# Altium schematic sheet RTL8367N.SchDoc
size A4; SheetNumber: 1; SheetTotal: 4
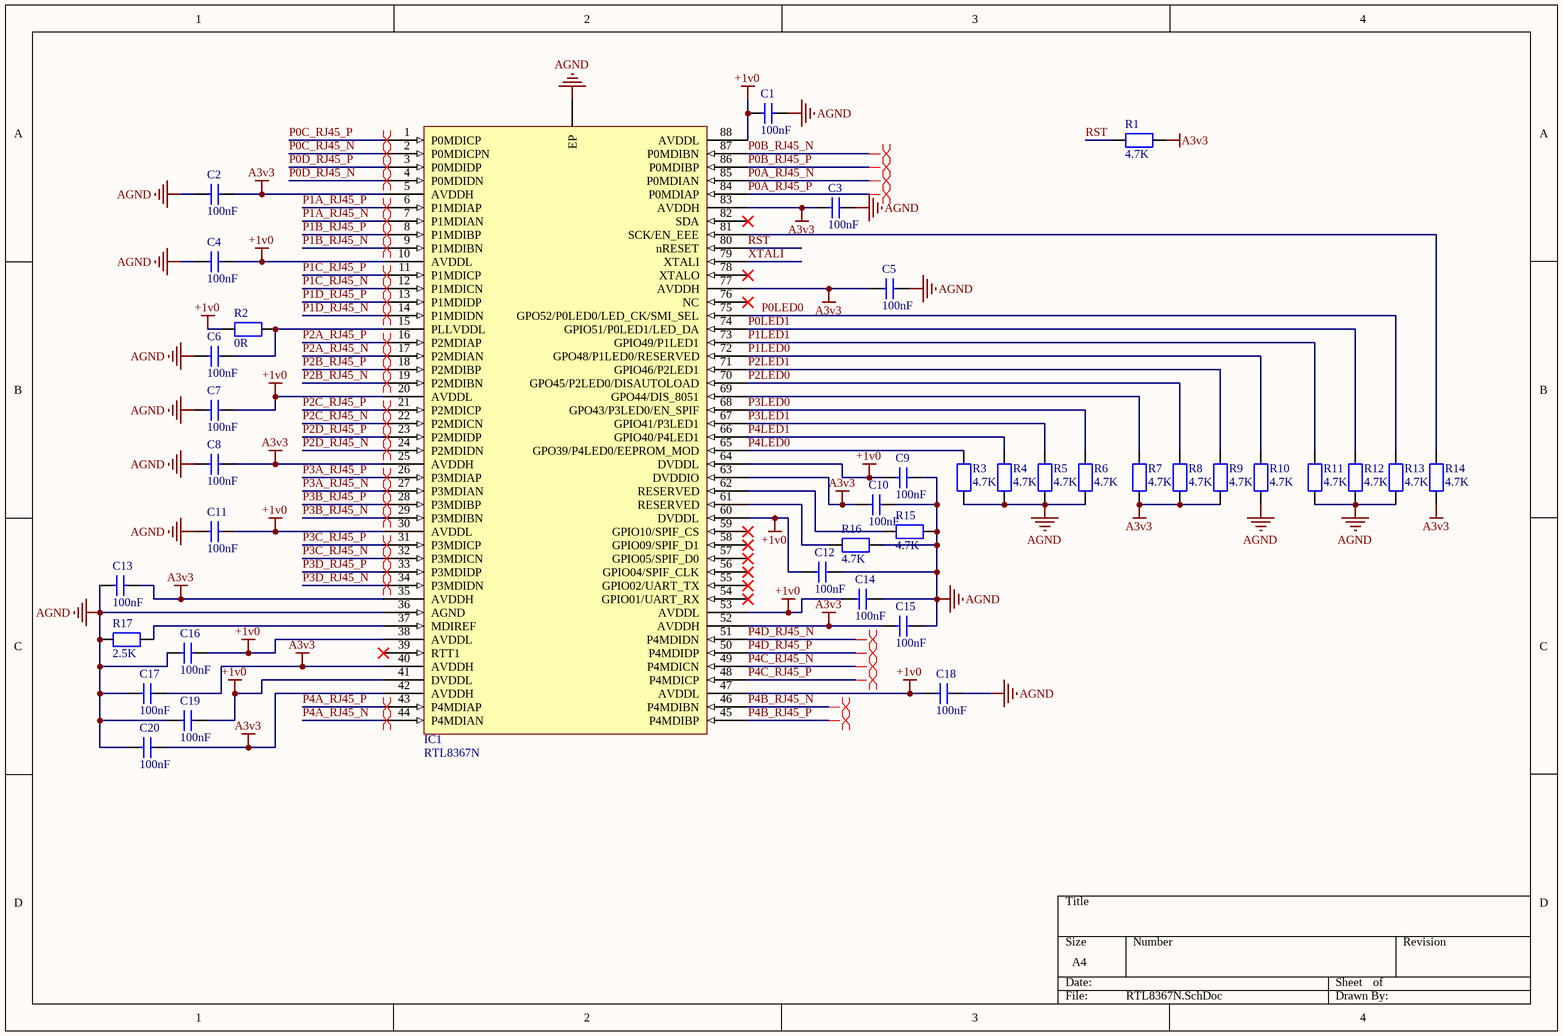
[diagram p0: RTL8367N.SchDoc]

## Parts
C1  100nF  [C-0603]
C2  100nF  [C-0603]
C3  100nF  [C-0603]
C4  100nF  [C-0603]
C5  100nF  [C-0603]
C6  100nF  [C-0603]
C7  100nF  [C-0603]
C8  100nF  [C-0603]
C9  100nF  [C-0603]
C10  100nF  [C-0603]
C11  100nF  [C-0603]
C12  100nF  [C-0603]
C13  100nF  [C-0603]
C14  100nF  [C-0603]
C15  100nF  [C-0603]
C16  100nF  [C-0603]
C17  100nF  [C-0603]
C18  100nF  [C-0603]
C19  100nF  [C-0603]
C20  100nF  [C-0603]
IC1  RTL8367N  [QFN40P1000X1000X90_HS-89M]
R1  4.7K  [RESMELF3515L]
R2  0R  [RESMELF3515L]
R3  4.7K  [RESMELF3515L]
R4  4.7K  [RESMELF3515L]
R5  4.7K  [RESMELF3515L]
R6  4.7K  [RESMELF3515L]
R7  4.7K  [RESMELF3515L]
R8  4.7K  [RESMELF3515L]
R9  4.7K  [RESMELF3515L]
R10  4.7K  [RESMELF3515L]
R11  4.7K  [RESMELF3515L]
R12  4.7K  [RESMELF3515L]
R13  4.7K  [RESMELF3515L]
R14  4.7K  [RESMELF3515L]
R15  4.7K  [RESMELF3515L]
R16  4.7K  [RESMELF3515L]
R17  2.5K  [RESMELF3515L]

## Nets
+1v0: C1.1 C4.2 C7.2 C9.1 C11.2 C12.1 C14.1 C16.2 C18.1 C19.2 IC1.10(AVDDL) IC1.20(AVDDL) IC1.30(AVDDL) IC1.38(AVDDL) IC1.41(DVDDL) IC1.47(AVDDL) IC1.53(AVDDL) IC1.60(DVDDL) IC1.64(DVDDL) IC1.88(AVDDL) R2.1
A3v3: C2.2 C3.1 C5.1 C8.2 C10.1 C13.2 C15.1 C17.2 C20.2 IC1.5(AVDDH) IC1.25(AVDDH) IC1.35(AVDDH) IC1.40(AVDDH) IC1.42(AVDDH) IC1.52(AVDDH) IC1.63(DVDDIO) IC1.77(AVDDH) IC1.83(AVDDH) R1.2 R7.1 R8.1 R9.1 R14.1
AGND: C1.2 C2.1 C3.2 C4.1 C5.2 C6.1 C7.1 C8.1 C9.2 C10.2 C11.1 C12.2 C13.1 C14.2 C15.2 C16.1 C17.1 C18.2 C19.1 C20.1 IC1.36(AGND) IC1.89(EP) R3.1 R4.1 R5.1 R6.1 R10.1 R11.1 R12.1 R13.1 R15.2 R16.2 R17.1
P0A_RJ45_N: IC1.85(P0MDIAN)
P0A_RJ45_P: IC1.84(P0MDIAP)
P0B_RJ45_N: IC1.87(P0MDIBN)
P0B_RJ45_P: IC1.86(P0MDIBP)
P0C_RJ45_N: IC1.2(P0MDICPN)
P0C_RJ45_P: IC1.1(P0MDICP)
P0D_RJ45_N: IC1.4(P0MDIDN)
P0D_RJ45_P: IC1.3(P0MDIDP)
P0LED0: IC1.75(GPO52/P0LED0/LED_CK/SMI_SEL) R13.2
P0LED1: IC1.74(GPIO51/P0LED1/LED_DA) R12.2
P1A_RJ45_N: IC1.7(P1MDIAN)
P1A_RJ45_P: IC1.6(P1MDIAP)
P1B_RJ45_N: IC1.9(P1MDIBN)
P1B_RJ45_P: IC1.8(P1MDIBP)
P1C_RJ45_N: IC1.12(P1MDICN)
P1C_RJ45_P: IC1.11(P1MDICP)
P1D_RJ45_N: IC1.14(P1MDIDN)
P1D_RJ45_P: IC1.13(P1MDIDP)
P1LED0: IC1.72(GPO48/P1LED0/RESERVED) R10.2
P1LED1: IC1.73(GPIO49/P1LED1) R11.2
P2A_RJ45_N: IC1.17(P2MDIAN)
P2A_RJ45_P: IC1.16(P2MDIAP)
P2B_RJ45_N: IC1.19(P2MDIBN)
P2B_RJ45_P: IC1.18(P2MDIBP)
P2C_RJ45_N: IC1.22(P2MDICN)
P2C_RJ45_P: IC1.21(P2MDICP)
P2D_RJ45_N: IC1.24(P2MDIDN)
P2D_RJ45_P: IC1.23(P2MDIDP)
P2LED0: IC1.70(GPO45/P2LED0/DISAUTOLOAD) R8.2
P2LED1: IC1.71(GPIO46/P2LED1) R9.2
P3A_RJ45_N: IC1.27(P3MDIAN)
P3A_RJ45_P: IC1.26(P3MDIAP)
P3B_RJ45_N: IC1.29(P3MDIBN)
P3B_RJ45_P: IC1.28(P3MDIBP)
P3C_RJ45_N: IC1.32(P3MDICN)
P3C_RJ45_P: IC1.31(P3MDICP)
P3D_RJ45_N: IC1.34(P3MDIDN)
P3D_RJ45_P: IC1.33(P3MDIDP)
P3LED0: IC1.68(GPO43/P3LED0/EN_SPIF) R6.2
P3LED1: IC1.67(GPIO41/P3LED1) R5.2
P4A_RJ45_N: IC1.44(P4MDIAN)
P4A_RJ45_P: IC1.43(P4MDIAP)
P4B_RJ45_N: IC1.46(P4MDIBN)
P4B_RJ45_P: IC1.45(P4MDIBP)
P4C_RJ45_N: IC1.49(P4MDICN)
P4C_RJ45_P: IC1.48(P4MDICP)
P4D_RJ45_N: IC1.51(P4MDIDN)
P4D_RJ45_P: IC1.50(P4MDIDP)
P4LED0: IC1.65(GPO39/P4LED0/EEPROM_MOD) R3.2
P4LED1: IC1.66(GPIO40/P4LED1) R4.2
RST: IC1.80(nRESET) R1.1
XTALI: IC1.79(XTALI)
NetC6_2: C6.2 IC1.15(PLLVDDL) R2.2
NetIC1_37: IC1.37(MDIREF) R17.2
NetIC1_61: IC1.61(RESERVED) R16.1
NetIC1_62: IC1.62(RESERVED) R15.1
NetIC1_69: IC1.69(GPO44/DIS_8051) R7.2
NetIC1_81: IC1.81(SCK/EN_EEE) R14.2

Not connected (* = marked no-connect by the designer): IC1 39(RTT1)* 54(GPIO01/UART_RX)* 55(GPIO02/UART_TX)* 56(GPIO04/SPIF_CLK)* 57(GPIO05/SPIF_D0)* 58(GPIO09/SPIF_D1)* 59(GPIO10/SPIF_CS)* 76(NC)* 78(XTALO)* 82(SDA)*

## Layout directives
differential pair: P0A_RJ45_N, P0A_RJ45_P, P0B_RJ45_N, P0B_RJ45_P, P0C_RJ45_N, P0C_RJ45_P, P0D_RJ45_N, P0D_RJ45_P, P1A_RJ45_N, P1A_RJ45_P, P1B_RJ45_N, P1B_RJ45_P, P1C_RJ45_N, P1C_RJ45_P, P1D_RJ45_N, P1D_RJ45_P, P2A_RJ45_N, P2A_RJ45_P, P2B_RJ45_N, P2B_RJ45_P, P2C_RJ45_N, P2C_RJ45_P, P2D_RJ45_N, P2D_RJ45_P, P3A_RJ45_N, P3A_RJ45_P, P3B_RJ45_N, P3B_RJ45_P, P3C_RJ45_N, P3C_RJ45_P, P3D_RJ45_N, P3D_RJ45_P, P4A_RJ45_N, P4A_RJ45_P, P4B_RJ45_N, P4B_RJ45_P, P4C_RJ45_N, P4C_RJ45_P, P4D_RJ45_N, P4D_RJ45_P

## Library data of the parts
C1-C20 = C-0603
IC1 = RTL8367N: RTL8367N-VB-CG
R1-R17 = CSR-0204